# Altium project Untitled1.PrjPcb
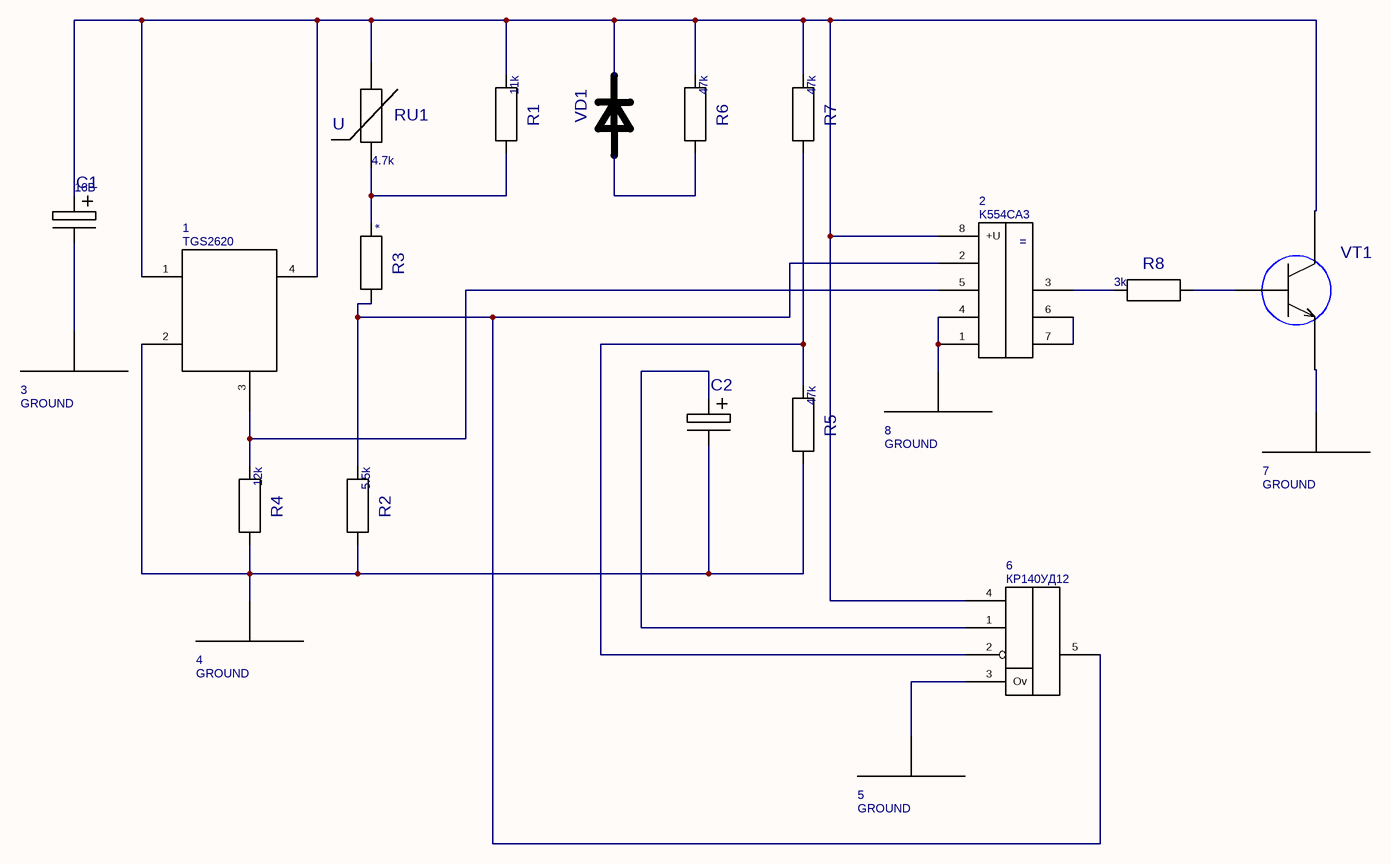
[diagram p0: Sheet1.SCHDOC]
1 sheet, 21 parts. Net scope: global (net labels, ports and power ports of the same name join across sheets).
Board file: Untitled1.PcbDoc

## Sheet Sheet1.SCHDOC
size 420 x 297 mm; SheetNumber: 1; SheetTotal: 1; DocumentName: Sheet1.SCHDOC

### Parts
1  TGS2620  [TGS2620]
2  K554CA3  [K554CA3]
3  GROUND  [GROUND]
4  GROUND  [GROUND]
5  GROUND  [GROUND]
6  КР140УД12  [КР140УД12]
7  GROUND  [GROUND]
8  GROUND  [GROUND]
C1  value 16B  [R50-35-08XX]  (hidden comment: К50-35-1000МКФ-6,3В)
C2  К50-35-220МКФ-10В-Г  [К50-35-0611-Г]  (value not drawn)
R1  value 11k  [PR03(VISHAY)]  (hidden comment: PR03(VISHAY))
R2  value 5.5k  [PR03(VISHAY)]  (hidden comment: PR03(VISHAY))
R3  PR03(VISHAY)  [PR03(VISHAY)]  (value not drawn)
R4  value 12k  [PR03(VISHAY)]  (hidden comment: PR03(VISHAY))
R5  value 47k  [PR03(VISHAY)]  (hidden comment: PR03(VISHAY))
R6  value 47k  [PR03(VISHAY)]  (hidden comment: PR03(VISHAY))
R7  value 47k  [PR03(VISHAY)]  (hidden comment: PR03(VISHAY))
R8  value 3k  [PR03(VISHAY)]  (hidden comment: PR03(VISHAY))
RU1  value 4.7k  [S07K230]  (hidden comment: SIOV-S07K300)
VD1  1N34  [DO-7]  (value not drawn)
VT1  2N4401  [TO-92-1]  (value not drawn)

### Nets
Net1_1: 1.1 1.4 2.8(+U) 6.4 C1.1 R1.1 R6.1 R7.1 RU1.2 VD1.K VT1.3(K)
Net1_2: 1.2 4.1 C2.2 R2.2 R4.2 R5.2
Net1_3: 1.3 2.5 R4.1
Net2_1: 2.1 2.4(Ov) 8.1
Net2_2: 2.2 6.5(+U) R2.1 R3.2
Net2_3: 2.3 R8.1
Net2_6: 2.6 2.7
Net3_1: 3.1 C1.2
Net5_1: 5.1 6.3(Ov)
Net6_1: 6.1 C2.1
Net6_2: 6.2 R5.1 R7.2
Net7_1: 7.1 VT1.1(E)
NetR1_2: R1.2 R3.1 RU1.1
NetR6_2: R6.2 VD1.A
NetR8_2: R8.2 VT1.2(B)

### Notes on the sheet
- (in symbol SIOV-S07K300) U

### Library data of the parts
1 = TGS2620: Value: *
2 = K554CA3: Value: *
3-5 7 8 = GROUND: Value: *
6 = КР140УД12: Value: *
C2 = К50-35-220МКФ-10В-Г: Value: *
R1-R8 = PR03(VISHAY)
  R3: Value: *
RU1 = SIOV-S07K300: Author: pcbdesigner.ru
VD1 = 1N34: Value: *
VT1 = 2N4401: Value: *